# Altium schematic sheet turnRacingMainInput.SchDoc
size A4
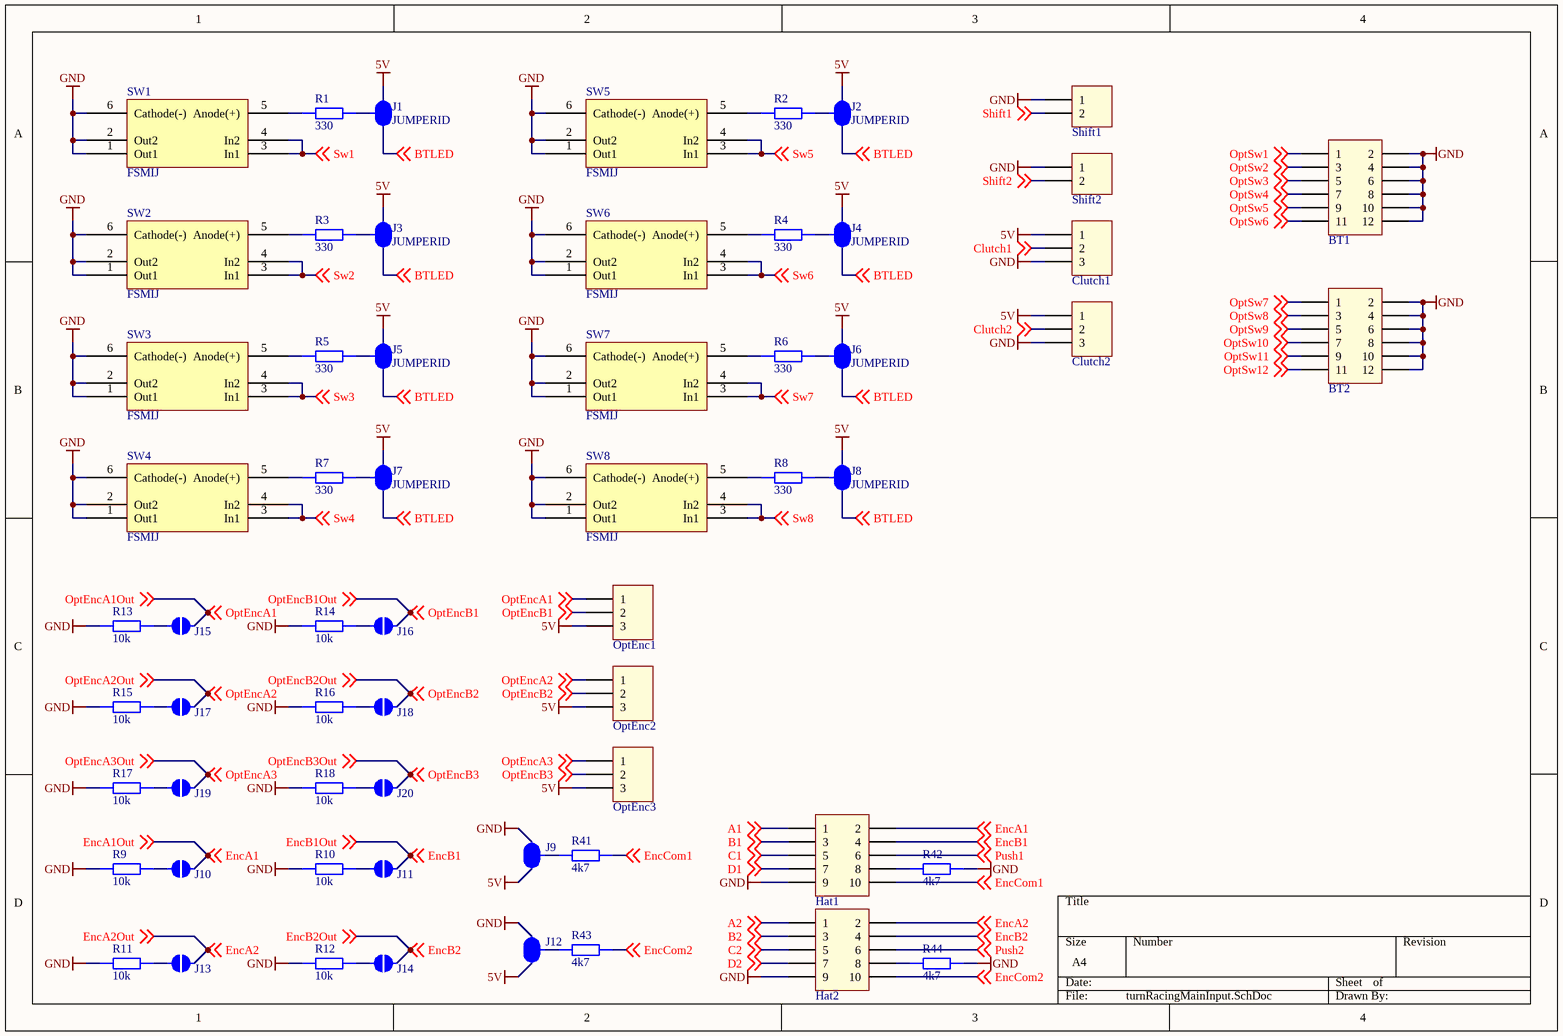
[diagram p0: turnRacingMainInput.SchDoc]

## Parts
BT1  61301221121  [61301221121]  (value not drawn)
BT2  61301221121  [61301221121]  (value not drawn)
Clutch1  61300311121  [61300311121]  (value not drawn)
Clutch2  61300311121  [61300311121]  (value not drawn)
Hat1  61301021121  [61301021121]  (value not drawn)
Hat2  61301021121  [61301021121]  (value not drawn)
J1  JUMPERID  [SMD-JUMPER-3]  (net tie, no BOM)
J2  JUMPERID  [SMD-JUMPER-3]  (net tie, no BOM)
J3  JUMPERID  [SMD-JUMPER-3]  (net tie, no BOM)
J4  JUMPERID  [SMD-JUMPER-3]  (net tie, no BOM)
J5  JUMPERID  [SMD-JUMPER-3]  (net tie, no BOM)
J6  JUMPERID  [SMD-JUMPER-3]  (net tie, no BOM)
J7  JUMPERID  [SMD-JUMPER-3]  (net tie, no BOM)
J8  JUMPERID  [SMD-JUMPER-3]  (net tie, no BOM)
J9  JUMPERID  [SMD-JUMPER-3]  (value not drawn)  (net tie, no BOM)
J10  SMD Jumper open  [SMD-JUMPER-OPEN]  (value not drawn)  (no BOM)
J11  SMD Jumper open  [SMD-JUMPER-OPEN]  (value not drawn)  (no BOM)
J12  JUMPERID  [SMD-JUMPER-3]  (value not drawn)  (net tie, no BOM)
J13  SMD Jumper open  [SMD-JUMPER-OPEN]  (value not drawn)  (no BOM)
J14  SMD Jumper open  [SMD-JUMPER-OPEN]  (value not drawn)  (no BOM)
J15  SMD Jumper open  [SMD-JUMPER-OPEN]  (value not drawn)  (no BOM)
J16  SMD Jumper open  [SMD-JUMPER-OPEN]  (value not drawn)  (no BOM)
J17  SMD Jumper open  [SMD-JUMPER-OPEN]  (value not drawn)  (no BOM)
J18  SMD Jumper open  [SMD-JUMPER-OPEN]  (value not drawn)  (no BOM)
J19  SMD Jumper open  [SMD-JUMPER-OPEN]  (value not drawn)  (no BOM)
J20  SMD Jumper open  [SMD-JUMPER-OPEN]  (value not drawn)  (no BOM)
OptEnc1  61300311121  [61300311121]  (value not drawn)
OptEnc2  61300311121  [61300311121]  (value not drawn)
OptEnc3  61300311121  [61300311121]  (value not drawn)
R1  value 330  [STACKPOLE CSR0603]  (hidden comment: SMD Resistor)
R2  value 330  [STACKPOLE CSR0603]  (hidden comment: SMD Resistor)
R3  value 330  [STACKPOLE CSR0603]  (hidden comment: SMD Resistor)
R4  value 330  [STACKPOLE CSR0603]  (hidden comment: SMD Resistor)
R5  value 330  [STACKPOLE CSR0603]  (hidden comment: SMD Resistor)
R6  value 330  [STACKPOLE CSR0603]  (hidden comment: SMD Resistor)
R7  value 330  [STACKPOLE CSR0603]  (hidden comment: SMD Resistor)
R8  value 330  [STACKPOLE CSR0603]  (hidden comment: SMD Resistor)
R9  value 10k  [STACKPOLE CSR0603]  (hidden comment: SMD Resistor)
R10  value 10k  [STACKPOLE CSR0603]  (hidden comment: SMD Resistor)
R11  value 10k  [STACKPOLE CSR0603]  (hidden comment: SMD Resistor)
R12  value 10k  [STACKPOLE CSR0603]  (hidden comment: SMD Resistor)
R13  value 10k  [STACKPOLE CSR0603]  (hidden comment: SMD Resistor)
R14  value 10k  [STACKPOLE CSR0603]  (hidden comment: SMD Resistor)
R15  value 10k  [STACKPOLE CSR0603]  (hidden comment: SMD Resistor)
R16  value 10k  [STACKPOLE CSR0603]  (hidden comment: SMD Resistor)
R17  value 10k  [STACKPOLE CSR0603]  (hidden comment: SMD Resistor)
R18  value 10k  [STACKPOLE CSR0603]  (hidden comment: SMD Resistor)
R41  value 4k7  [STACKPOLE CSR0603]  (hidden comment: SMD Resistor)
R42  value 4k7  [STACKPOLE CSR0603]  (hidden comment: SMD Resistor)
R43  value 4k7  [STACKPOLE CSR0603]  (hidden comment: SMD Resistor)
R44  value 4k7  [STACKPOLE CSR0603]  (hidden comment: SMD Resistor)
Shift1  61300211121  [61300211121]  (value not drawn)
Shift2  61300211121  [61300211121]  (value not drawn)
SW1  FSMIJ  [FSMIJ]
SW2  FSMIJ  [FSMIJ]
SW3  FSMIJ  [FSMIJ]
SW4  FSMIJ  [FSMIJ]
SW5  FSMIJ  [FSMIJ]
SW6  FSMIJ  [FSMIJ]
SW7  FSMIJ  [FSMIJ]
SW8  FSMIJ  [FSMIJ]

## Nets
5V: Clutch1.1 Clutch2.1 J1.3 J2.3 J3.3 J4.3 J5.3 J6.3 J7.3 J8.3 J9.3 J12.3 OptEnc1.3 OptEnc2.3 OptEnc3.3
GND: BT1.2 BT1.4 BT1.6 BT1.8 BT1.10 BT1.12 BT2.2 BT2.4 BT2.6 BT2.8 BT2.10 BT2.12 Clutch1.3 Clutch2.3 Hat1.9 Hat2.9 J9.1 J12.1 R9.2 R10.2 R11.2 R12.2 R13.2 R14.2 R15.2 R16.2 R17.2 R18.2 R42.1 R44.1 Shift1.1 Shift2.1 SW1.1(Out1) SW1.2(Out2) SW1.6(Cathode(-)) SW2.1(Out1) SW2.2(Out2) SW2.6(Cathode(-)) SW3.1(Out1) SW3.2(Out2) SW3.6(Cathode(-)) SW4.1(Out1) SW4.2(Out2) SW4.6(Cathode(-)) SW5.1(Out1) SW5.2(Out2) SW5.6(Cathode(-)) SW6.1(Out1) SW6.2(Out2) SW6.6(Cathode(-)) SW7.1(Out1) SW7.2(Out2) SW7.6(Cathode(-)) SW8.1(Out1) SW8.2(Out2) SW8.6(Cathode(-))
A1: Hat1.1 ; off-sheet A1
A2: Hat2.1 ; off-sheet A2
B1: Hat1.3 ; off-sheet B1
B2: Hat2.3 ; off-sheet B2
BTLED: J1.1 J2.1 J3.1 J4.1 J5.1 J6.1 J7.1 J8.1 ; off-sheet BTLED
C1: Hat1.5 ; off-sheet C1
C2: Hat2.5 ; off-sheet C2
Clutch1: Clutch1.2 ; off-sheet Clutch1
Clutch2: Clutch2.2 ; off-sheet Clutch2
D1: Hat1.7 ; off-sheet D1
D2: Hat2.7 ; off-sheet D2
EncA1: Hat1.2 J10.1 ; off-sheet EncA1, off-sheet EncA1Out  [also labelled EncA1Out]
EncA2: Hat2.2 J13.1 ; off-sheet EncA2, off-sheet EncA2Out  [also labelled EncA2Out]
EncB1: Hat1.4 J11.1 ; off-sheet EncB1, off-sheet EncB1Out  [also labelled EncB1Out]
EncB2: Hat2.4 J14.1 ; off-sheet EncB2, off-sheet EncB2Out  [also labelled EncB2Out]
EncCom1: Hat1.10 R41.1 ; off-sheet EncCom1
EncCom2: Hat2.10 R43.1 ; off-sheet EncCom2
OptEncA1: J15.1 OptEnc1.1 ; off-sheet OptEncA1Out, off-sheet OptEncA1  [also labelled OptEncA1Out]
OptEncA2: J17.1 OptEnc2.1 ; off-sheet OptEncA2Out, off-sheet OptEncA2  [also labelled OptEncA2Out]
OptEncA3: J19.1 OptEnc3.1 ; off-sheet OptEncA3Out, off-sheet OptEncA3  [also labelled OptEncA3Out]
OptEncB1: J16.1 OptEnc1.2 ; off-sheet OptEncB1Out, off-sheet OptEncB1  [also labelled OptEncB1Out]
OptEncB2: J18.1 OptEnc2.2 ; off-sheet OptEncB2Out, off-sheet OptEncB2  [also labelled OptEncB2Out]
OptEncB3: J20.1 OptEnc3.2 ; off-sheet OptEncB3Out, off-sheet OptEncB3  [also labelled OptEncB3Out]
OptSw1: BT1.1 ; off-sheet OptSw1
OptSw2: BT1.3 ; off-sheet OptSw2
OptSw3: BT1.5 ; off-sheet OptSw3
OptSw4: BT1.7 ; off-sheet OptSw4
OptSw5: BT1.9 ; off-sheet OptSw5
OptSw6: BT1.11 ; off-sheet OptSw6
OptSw7: BT2.1 ; off-sheet OptSw7
OptSw8: BT2.3 ; off-sheet OptSw8
OptSw9: BT2.5 ; off-sheet OptSw9
OptSw10: BT2.7 ; off-sheet OptSw10
OptSw11: BT2.9 ; off-sheet OptSw11
OptSw12: BT2.11 ; off-sheet OptSw12
Push1: Hat1.6 ; off-sheet Push1
Push2: Hat2.6 ; off-sheet Push2
Shift1: Shift1.2 ; off-sheet Shift1
Shift2: Shift2.2 ; off-sheet Shift2
Sw1: SW1.3(In1) SW1.4(In2) ; off-sheet Sw1
Sw2: SW2.3(In1) SW2.4(In2) ; off-sheet Sw2
Sw3: SW3.3(In1) SW3.4(In2) ; off-sheet Sw3
Sw4: SW4.3(In1) SW4.4(In2) ; off-sheet Sw4
Sw5: SW5.3(In1) SW5.4(In2) ; off-sheet Sw5
Sw6: SW6.3(In1) SW6.4(In2) ; off-sheet Sw6
Sw7: SW7.3(In1) SW7.4(In2) ; off-sheet Sw7
Sw8: SW8.3(In1) SW8.4(In2) ; off-sheet Sw8
NetHat1_8: Hat1.8 R42.2
NetHat2_8: Hat2.8 R44.2
NetJ1_2: J1.2 R1.1
NetJ2_2: J2.2 R2.1
NetJ3_2: J3.2 R3.1
NetJ4_2: J4.2 R4.1
NetJ5_2: J5.2 R5.1
NetJ6_2: J6.2 R6.1
NetJ7_2: J7.2 R7.1
NetJ8_2: J8.2 R8.1
NetJ9_2: J9.2 R41.2
NetJ10_2: J10.2 R9.1
NetJ11_2: J11.2 R10.1
NetJ12_2: J12.2 R43.2
NetJ13_2: J13.2 R11.1
NetJ14_2: J14.2 R12.1
NetJ15_2: J15.2 R13.1
NetJ16_2: J16.2 R14.1
NetJ17_2: J17.2 R15.1
NetJ18_2: J18.2 R16.1
NetJ19_2: J19.2 R17.1
NetJ20_2: J20.2 R18.1
NetR1_2: R1.2 SW1.5(Anode(+))
NetR2_2: R2.2 SW5.5(Anode(+))
NetR3_2: R3.2 SW2.5(Anode(+))
NetR4_2: R4.2 SW6.5(Anode(+))
NetR5_2: R5.2 SW3.5(Anode(+))
NetR6_2: R6.2 SW7.5(Anode(+))
NetR7_2: R7.2 SW4.5(Anode(+))
NetR8_2: R8.2 SW8.5(Anode(+))

## Library data of the parts
BT1 BT2 = 61301221121: WR-PHD 2.54 mm THT Dual Pin Header, 12p; Pin Number: 12; Rated Current: 3 A; Working Voltage: 250 VAC; Withstanding Voltage: 500 VAC; Pitch: 2.54 mm; ComponentLink1Description: Manufacturer; ComponentLink1URL: http://www.we-online.de; ComponentLink2Description: Datasheet; ComponentLink2URL: http://katalog.we-online.de/em/datasheet/6130xx21121.pdf; Part Number: 61301221121; Published Date: Aug 2017; Publisher: Wurth Elektronik
Clutch1 Clutch2 OptEnc1-OptEnc3 = 61300311121: WR-PHD 2.54 mm THT Pin Header, 3p; Pin Number: 3; Rated Current: 3 A; Working Voltage: 250 VAC; Withstanding Voltage: 500 VAC; Pitch: 2.54 mm; ComponentLink1Description: Manufacturer; ComponentLink1URL: http://www.we-online.de; ComponentLink2Description: Datasheet; ComponentLink2URL: http://katalog.we-online.de/em/datasheet/6130xx11121.pdf; Part Number: 61300311121; Published Date: Aug 2017; Publisher: Wurth Elektronik
Hat1 Hat2 = 61301021121: WR-PHD 2.54 mm THT Dual Pin Header, 10p; Pin Number: 10; Rated Current: 3 A; Working Voltage: 250 VAC; Withstanding Voltage: 500 VAC; Pitch: 2.54 mm; ComponentLink1Description: Manufacturer; ComponentLink1URL: http://www.we-online.de; ComponentLink2Description: Datasheet; ComponentLink2URL: http://katalog.we-online.de/em/datasheet/6130xx21121.pdf; Part Number: 61301021121; Published Date: Aug 2017; Publisher: Wurth Elektronik
J1-J9 J12 = SMD Jumper 3
R1-R18 R41-R44 = SMD Resistor: Resistor with multiple footprints
Shift1 Shift2 = 61300211121: WR-PHD 2.54 mm THT Pin Header, 2p; Pin Number: 2; Rated Current: 3 A; Working Voltage: 250 VAC; Withstanding Voltage: 500 VAC; Pitch: 2.54 mm; ComponentLink1Description: Manufacturer; ComponentLink1URL: http://www.we-online.de; ComponentLink2Description: Datasheet; ComponentLink2URL: http://katalog.we-online.de/em/datasheet/6130xx11121.pdf; Part Number: 61300211121; Published Date: Aug 2017; Publisher: Wurth Elektronik